# EAGLE schematic untitled (EAGLE 9.6.2)
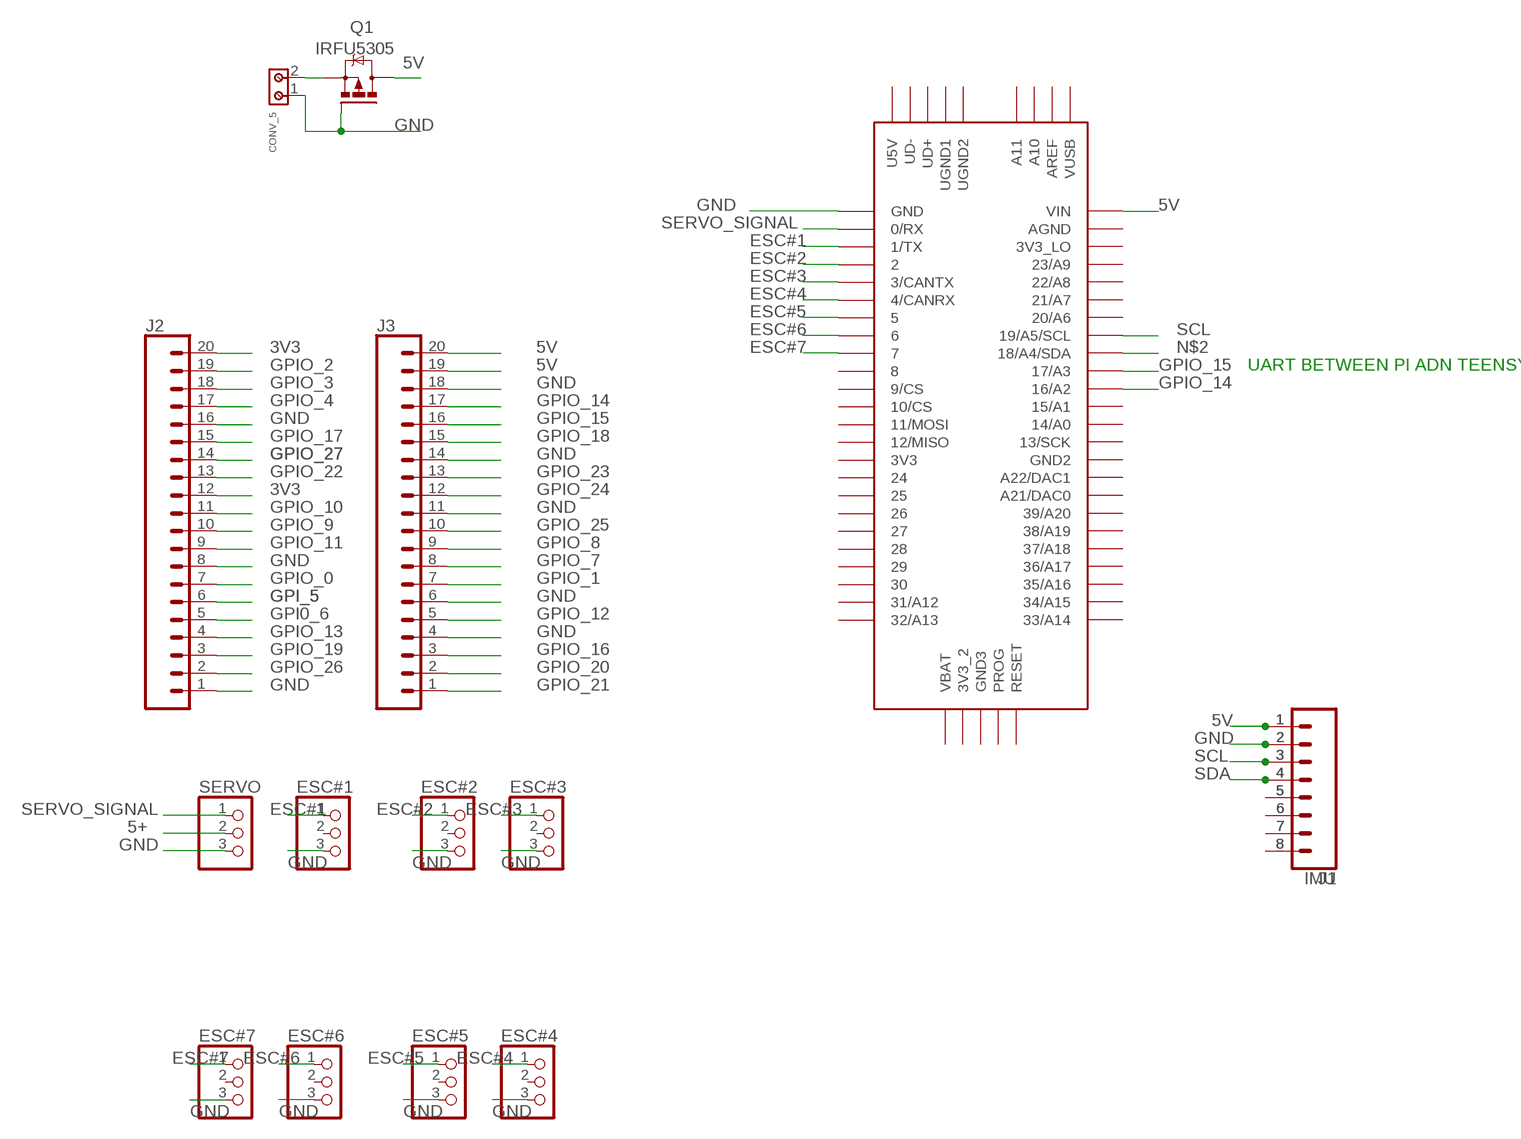
[diagram p0: schematic, sheet 1]

## Parts
CONV_5  691213500002  [691213500002]
ESC#1  PINHD-1X3  [1X03]
ESC#2  PINHD-1X3  [1X03]
ESC#3  PINHD-1X3  [1X03]
ESC#4  PINHD-1X3  [1X03]
ESC#5  PINHD-1X3  [1X03]
ESC#6  PINHD-1X3  [1X03]
ESC#7  PINHD-1X3  [1X03]
IMU  CONN_08"  [1X08]
J1  CONN_08"  [1X08]
J2  CONN_20  [1X20]
J3  CONN_20  [1X20]
Q1  IRFU5305  [I-PAK_TO251AA]
SERVO  PINHD-1X3  [1X03]
U$1  TEENSY_3.5/3.6  [TEENSY_3.5/3.6]

## Nets
3V3: J2.12 J2.20
5+: SERVO.2
5V: IMU.1 J1.1 J3.19 J3.20 Q1.2(D) U$1.VIN
ESC#1: ESC#1.1 U$1.1/TX
ESC#2: ESC#2.1 U$1.2
ESC#3: ESC#3.1 U$1.3/CANTX
ESC#4: ESC#4.1 U$1.4/CANRX
ESC#5: ESC#5.1 U$1.5
ESC#6: ESC#6.1 U$1.6
ESC#7: ESC#7.1 U$1.7
GND: CONV_5.1 ESC#1.3 ESC#2.3 ESC#3.3 ESC#4.3 ESC#5.3 ESC#6.3 ESC#7.3 IMU.2 J1.2 J2.1 J2.8 J2.16 J3.4 J3.6 J3.11 J3.14 J3.18 Q1.1(G) SERVO.3 U$1.GND
GPI0_6: J2.5
GPI_5: J2.6
GPIO_0: J2.7
GPIO_1: J3.7
GPIO_2: J2.19
GPIO_3: J2.18
GPIO_4: J2.17
GPIO_7: J3.8
GPIO_8: J3.9
GPIO_9: J2.10
GPIO_10: J2.11
GPIO_11: J2.9
GPIO_12: J3.5
GPIO_13: J2.4
GPIO_14: J3.17 U$1.16/A2
GPIO_15: J3.16 U$1.17/A3
GPIO_16: J3.3
GPIO_17: J2.15
GPIO_18: J3.15
GPIO_19: J2.3
GPIO_20: J3.2
GPIO_21: J3.1
GPIO_22: J2.13
GPIO_23: J3.13
GPIO_24: J3.12
GPIO_25: J3.10
GPIO_26: J2.2
GPIO_27: J2.14
N$2: U$1.18/A4/SDA
N$3: CONV_5.2 Q1.3(S)
N$6: IMU.5 J1.5
N$7: IMU.6 J1.6
N$8: IMU.7 J1.7
N$9: IMU.8 J1.8
SCL: IMU.3 J1.3 U$1.19/A5/SCL
SDA: IMU.4 J1.4
SERVO_SIGNAL: SERVO.1 U$1.0/RX
Unconnected: ESC#1.2 ESC#2.2 ESC#3.2 ESC#4.2 ESC#5.2 ESC#6.2 ESC#7.2 U$1.3V3 U$1.3V3_2 U$1.3V3_LO U$1.8 U$1.9/CS U$1.10/CS U$1.11/MOSI U$1.12/MISO U$1.13/SCK U$1.14/A0 U$1.15/A1 U$1.20/A6 U$1.21/A7 U$1.21/DAC0(A21/DAC0) U$1.22/A8 U$1.23/A9 U$1.24 U$1.25 U$1.26 U$1.27 U$1.28 U$1.29 U$1.30 U$1.31/A12 U$1.32/A13 U$1.33/A14 U$1.34/A15 U$1.35/A16 U$1.36/A17 U$1.37/A18 U$1.38/A19 U$1.39/A20 U$1.A10 U$1.A11 U$1.A22/DAC1 U$1.AGND U$1.AREF U$1.GND2 U$1.GND3 U$1.PROG U$1.RESET U$1.U5V U$1.UD+ U$1.UD- U$1.UGND1 U$1.UGND2 U$1.VBAT U$1.VUSB

## Notes on the sheet
- UART BETWEEN PI ADN TEENSY

## Library data of the parts
CONV_5 = Wurth_Connectors_WR-TBL Rising Cage Clamp:691213500002: WR-TBL Serie 2135 - 5.08 mm Vertical Entry Modular w. Rising Cage Clamp KIND PROPERTIES Pitch 5.08 mm MATERIAL PROPERTIES Insulator Material PA66 Insulator Flammability Rating UL94 V-0 Contact Material Copper Alloy Contact Plating Tin over Nickel Terminal Screw Material Steel Terminal Screw Plating Zinc Wire Guard Material Copper Alloy GENERAL INFORMATION Operating Temperature -30 up to +120 °C Compliance RoHS ELECTRICAL PROPERTIES IR cULus 14 A IR VDE 14 A Working Voltage [cULus] 300 V (AC) Working Voltage [VDE] 250 V (AC) Withstanding Voltage [UL] 1600 V (AC) Withstanding Voltage [cULus] 1600 Withstanding Voltage [VDE] 2000 Contact Resistance [cULus] 20 mΩ Contact Resistance [VDE] 20 mΩ MECHANICAL PROPERTIES Wire Strip Length 6 Screw M3 CERTIFICATION cULus Approval E150931 VDE Approval 40021366 PACKAGING PROPERTIES Packaging Box <https://www.we-online.com/catalog/media/o58403v209%20Family_WR-TBL_5_08_2135_VERTICAL_CABLE_ENTRY_W_RISING_CLAMP_6912135000XX.jpg> Details see: https://www.we-online.com/catalog/en/TBL_5_08_2135_VERTICAL_CABLE_ENTRY_W_RISING_CLAMP_6912135000XX/ Updated by Ella Wu 2019-11-26 2019(C) Wurth Elektronik; IR-UL: 14A; IR-VDE: 14A; PART-NUMBER: 691213500002; PINS: 2; PITCH: 5.08mm; TYPE: Vertical; WIRE: 14 to 30 (AWG) 2.08 to 0.0509 (mm²); WORKING-VOLTAGE-UL: 300V (AC); WORKING-VOLTAGE-VDE: 250V (AC)
ESC#1-ESC#7 SERVO = adafruit:PINHD-1X3: PIN HEADER
IMU J1 = SparkFun-Connectors:CONN_08: Multi connection point. Often used as Generic Header-pin footprint for 0.1 inch spaced/style header connections On any of the 0.1 inch spaced packages, you can populate with these: Break Away Headers - Straight <https://www.sparkfun.com/products/116> (PRT-00116) Break Away Male Headers - Right Angle <https://www.sparkfun.com/products/553> (PRT-00553) Female Headers <https://www.sparkfun.com/products/115> (PRT-00115) Break Away Headers - Machine Pin <https://www.sparkfun.com/products/117> (PRT-00117) Break Away Female Headers - Swiss Machine Pin <https://www.sparkfun.com/products/743> (PRT-00743) Arduino Stackable Header - 8 Pin <https://www.sparkfun.com/products/9279> (PRT-09279) For SCREWTERMINALS and SPRING TERMINALS visit here: Screw Terimnals on SparkFun.com <https://www.sparkfun.com/search/results?term=Screw+Terminals> (5mm/3.5mm/2.54mm spacing) This device is also useful as a general connection point to wire up your design to another part of your project. Our various solder wires solder well into these plated through hole pads. Hook-Up Wire - Assortment (Stranded, 22 AWG) <https://www.sparkfun.com/products/11375> (PRT-11375) Hook-Up Wire - Assortment (Solid Core, 22 AWG) <https://www.sparkfun.com/products/11367> (PRT-11367) View the entire wire category on our website here <https://www.sparkfun.com/categories/141> Special notes: Molex polarized connector foot print use with SKU : PRT-08231 with associated crimp pins and housings. 1MM SMD Version SKU: PRT-10208 NOTES ON THE VARIANTS LOCK and LOCK_LONGPADS... This footprint was designed to help hold the alignment of a through-hole component (i.e. 6-pin header) while soldering it into place. You may notice that each hole has been shifted either up or down by 0.005 of an inch from it's more standard position (which is a perfectly straight line). This slight alteration caused the pins (the squares in the middle) to touch the edges of the holes. Because they are alternating, it causes a "brace" to hold the component in place. 0.005 has proven to be the perfect amount of "off-center" position when using our standard breakaway headers. Although looks a little odd when you look at the bare footprint, once you have a header in there, the alteration is very hard to notice. Also,if you push a header all the way into place, it is covered up entirely on the bottom side.; PROD_ID: CONN-08438
J2 J3 = SparkFun-Connectors:CONN_20: Multi connection point. Often used as Generic Header-pin footprint for 0.1 inch spaced/style header connections On any of the 0.1 inch spaced packages, you can populate with these: Break Away Headers - Straight <https://www.sparkfun.com/products/116> (PRT-00116) Break Away Male Headers - Right Angle <https://www.sparkfun.com/products/553> (PRT-00553) Female Headers <https://www.sparkfun.com/products/115> (PRT-00115) Break Away Headers - Machine Pin <https://www.sparkfun.com/products/117> (PRT-00117) Break Away Female Headers - Swiss Machine Pin <https://www.sparkfun.com/products/743> (PRT-00743) For SCREWTERMINALS and SPRING TERMINALS visit here: Screw Terimnals on SparkFun.com <https://www.sparkfun.com/search/results?term=Screw+Terminals> (5mm/3.5mm/2.54mm spacing) This device is also useful as a general connection point to wire up your design to another part of your project. Our various solder wires solder well into these plated through hole pads. Hook-Up Wire - Assortment (Stranded, 22 AWG) <https://www.sparkfun.com/products/11375> (PRT-11375) Hook-Up Wire - Assortment (Solid Core, 22 AWG) <https://www.sparkfun.com/products/11367> (PRT-11367) View the entire wire category on our website here <https://www.sparkfun.com/categories/141> Special notes: Molex polarized connector foot print use with SKU : PRT-08231 with associated crimp pins and housings. 1MM SMD Version SKU: PRT-10208 NOTES ON THE VARIANTS LOCK and LOCK_LONGPADS... This footprint was designed to help hold the alignment of a through-hole component (i.e. 6-pin header) while soldering it into place. You may notice that each hole has been shifted either up or down by 0.005 of an inch from it's more standard position (which is a perfectly straight line). This slight alteration caused the pins (the squares in the middle) to touch the edges of the holes. Because they are alternating, it causes a "brace" to hold the component in place. 0.005 has proven to be the perfect amount of "off-center" position when using our standard breakaway headers. Although looks a little odd when you look at the bare footprint, once you have a header in there, the alteration is very hard to notice. Also,if you push a header all the way into place, it is covered up entirely on the bottom side. Note about LOCK SPECIAL package: This is just like the LOCK variant in that the holes are staggared by 5 mil, but except for the last two holes. They are not altered from the "standard" footprint layout. This is used for a special purpose on the layout of our Graphic LCD Backpack. Make sure you want to use this device before selecting it for you project!
Q1 = transistor-power:IRF?5305: HEXFET Power MOSFET Source: http://www.irf.com/product-info/datasheets/data/irfr5305pbf.pdf
U$1 = Teensy356:TEENSY_3.5/3.6